# Altium project OPTO_board.PrjPcb
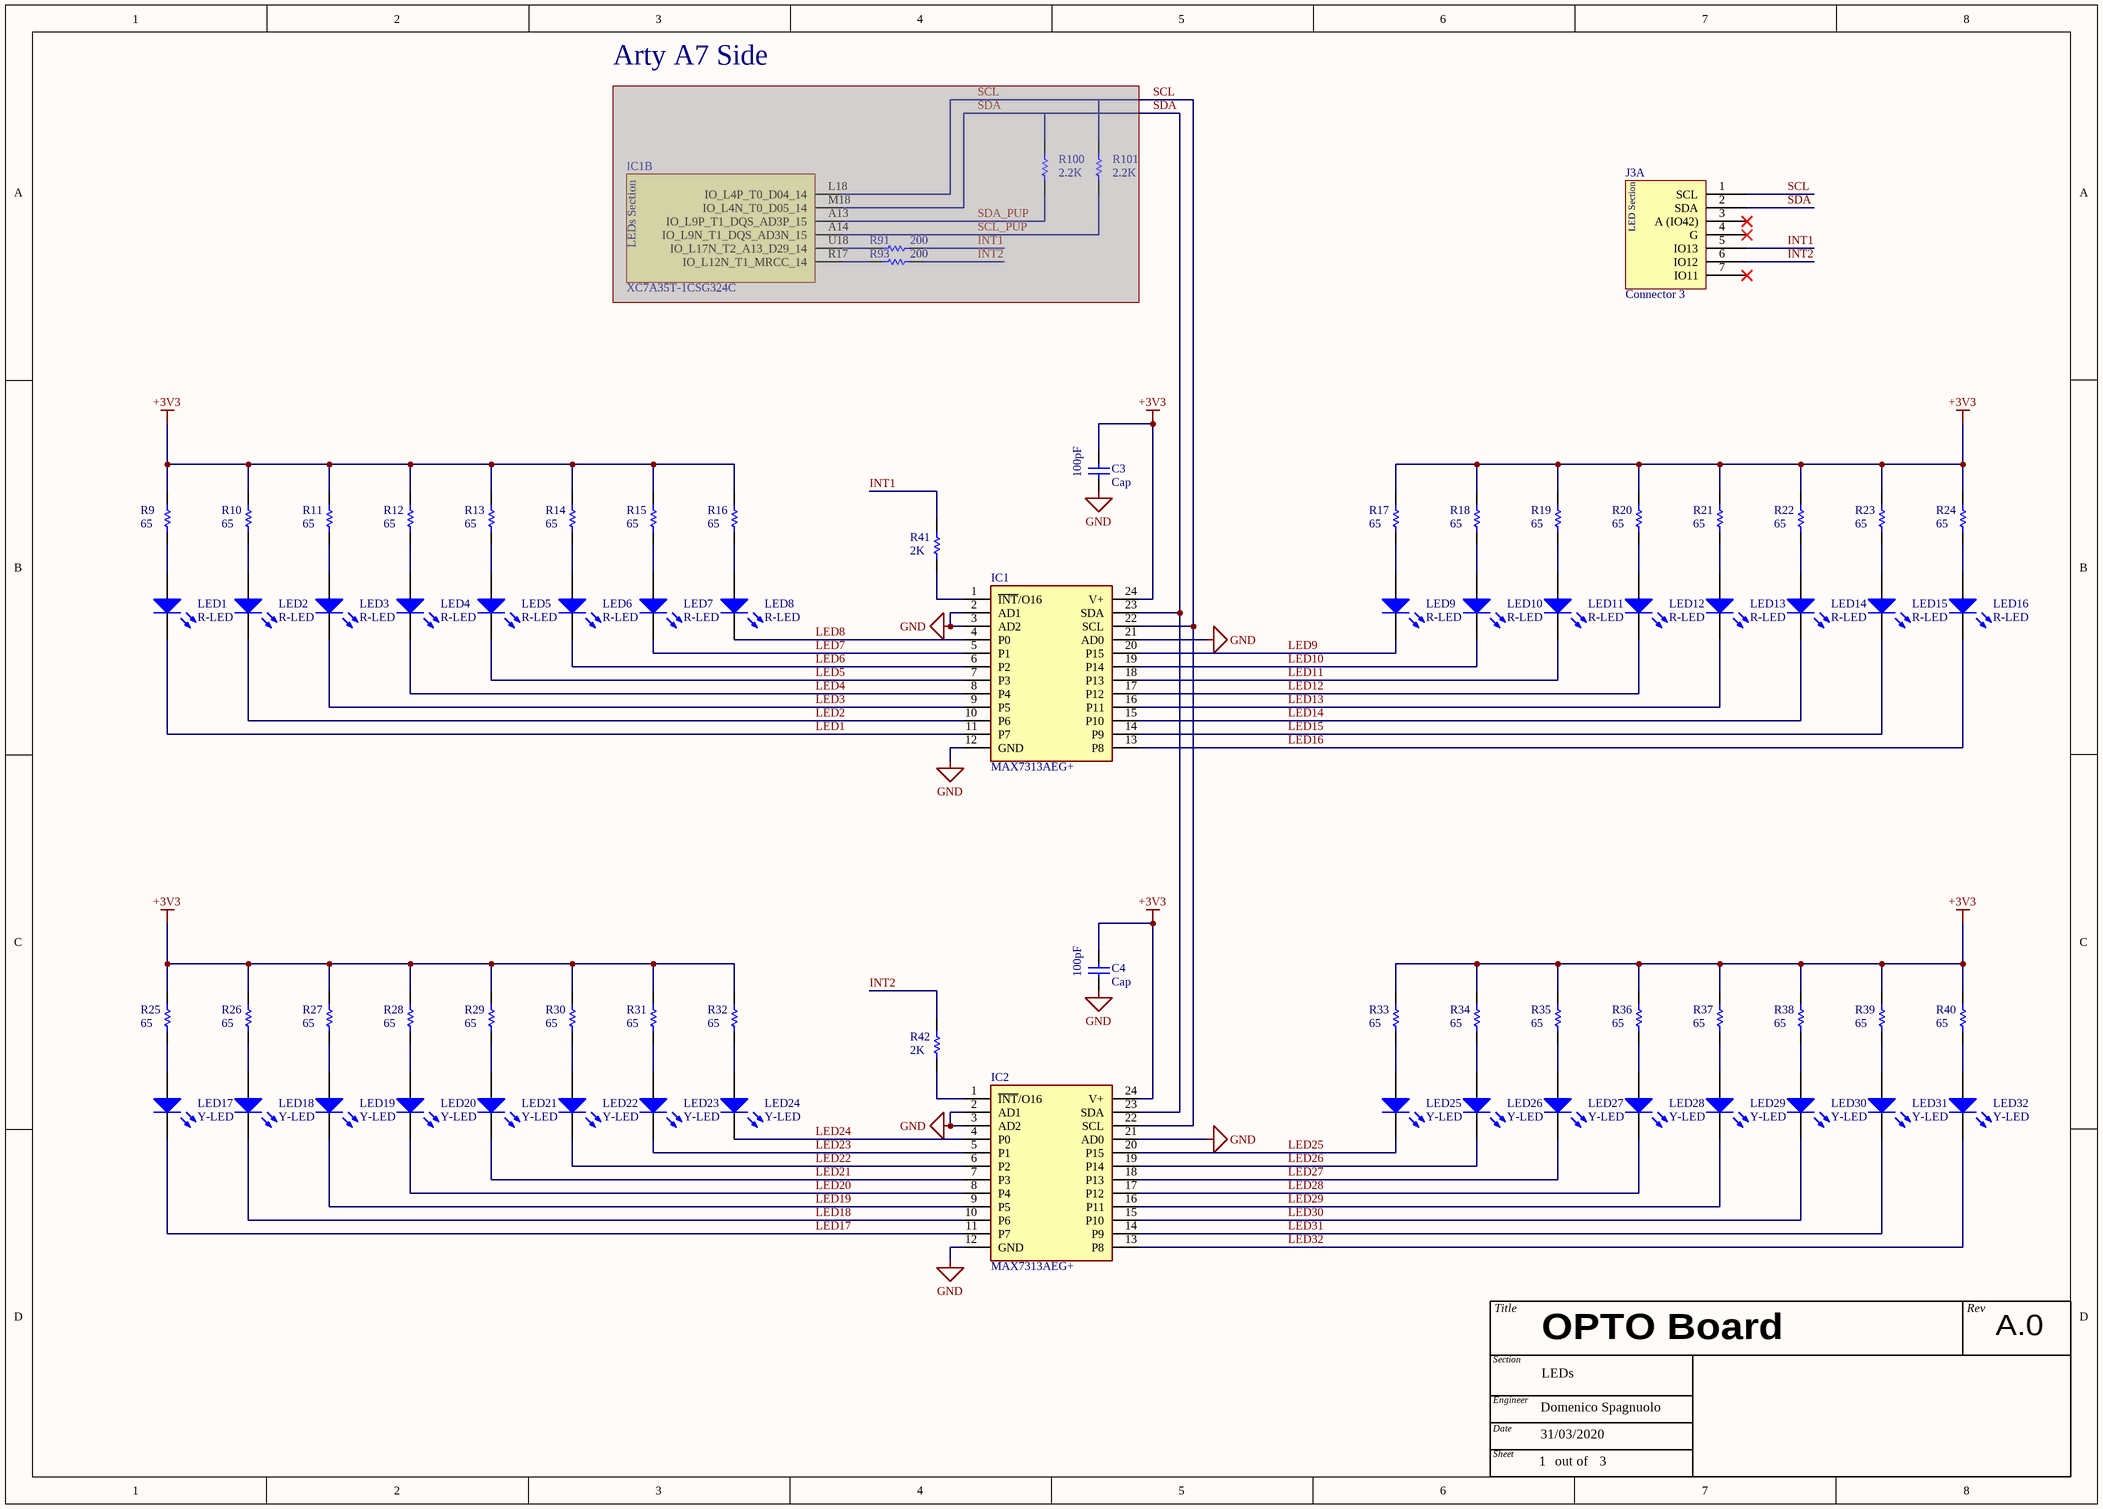
[diagram p0: LEDs.SchDoc]
Engineer: Domenico Spagnuolo; Rev: A.0
3 sheets, 131 parts. Net scope: global (net labels, ports and power ports of the same name join across sheets).
Board file: OPTO_board.PcbDoc
Sheets:
  LEDs.SchDoc
  LCD.SchDoc
  SevenSegmentDisplay.SchDoc

## Sheet LEDs.SchDoc: OPTO Board
size A3; Date: 31/03/2020; Engineer: Domenico Spagnuolo; DocumentNumber: 1; SheetNumber: 1; SheetTotal: 3; Section: LEDs

### Parts
(Parts that share a designator on the sheet are numbered #1, #2 ... from top to bottom, then left to right.)
C3  Cap  value 100pF  [CAP 0805]
C4  Cap  value 100pF  [CAP 0805]
IC1#1  XC7A35T-1CSG324C  [BGA324C80P18X18_1500X1500X150]  (part B of 3)  (masked out: inside a compile mask, not in the netlist)
IC1#2  MAX7313AEG+  [SOP64P602X175-24N]
IC2  MAX7313AEG+  [SOP64P602X175-24N]
J3  Connector 3  [1x10 Header]  (part A of 2)
LED1  R-LED  [LED RED 0805]
LED2  R-LED  [LED RED 0805]
LED3  R-LED  [LED RED 0805]
LED4  R-LED  [LED RED 0805]
LED5  R-LED  [LED RED 0805]
LED6  R-LED  [LED RED 0805]
LED7  R-LED  [LED RED 0805]
LED8  R-LED  [LED RED 0805]
LED9  R-LED  [LED RED 0805]
LED10  R-LED  [LED RED 0805]
LED11  R-LED  [LED RED 0805]
LED12  R-LED  [LED RED 0805]
LED13  R-LED  [LED RED 0805]
LED14  R-LED  [LED RED 0805]
LED15  R-LED  [LED RED 0805]
LED16  R-LED  [LED RED 0805]
LED17  Y-LED  [LED YELLOW 0805]
LED18  Y-LED  [LED YELLOW 0805]
LED19  Y-LED  [LED YELLOW 0805]
LED20  Y-LED  [LED YELLOW 0805]
LED21  Y-LED  [LED YELLOW 0805]
LED22  Y-LED  [LED YELLOW 0805]
LED23  Y-LED  [LED YELLOW 0805]
LED24  Y-LED  [LED YELLOW 0805]
LED25  Y-LED  [LED YELLOW 0805]
LED26  Y-LED  [LED YELLOW 0805]
LED27  Y-LED  [LED YELLOW 0805]
LED28  Y-LED  [LED YELLOW 0805]
LED29  Y-LED  [LED YELLOW 0805]
LED30  Y-LED  [LED YELLOW 0805]
LED31  Y-LED  [LED YELLOW 0805]
LED32  Y-LED  [LED YELLOW 0805]
R9  value 65  [RES 0805]  (hidden comment: Res)
R10  value 65  [RES 0805]  (hidden comment: Res)
R11  value 65  [RES 0805]  (hidden comment: Res)
R12  value 65  [RES 0805]  (hidden comment: Res)
R13  value 65  [RES 0805]  (hidden comment: Res)
R14  value 65  [RES 0805]  (hidden comment: Res)
R15  value 65  [RES 0805]  (hidden comment: Res)
R16  value 65  [RES 0805]  (hidden comment: Res)
R17  value 65  [RES 0805]  (hidden comment: Res)
R18  value 65  [RES 0805]  (hidden comment: Res)
R19  value 65  [RES 0805]  (hidden comment: Res)
R20  value 65  [RES 0805]  (hidden comment: Res)
R21  value 65  [RES 0805]  (hidden comment: Res)
R22  value 65  [RES 0805]  (hidden comment: Res)
R23  value 65  [RES 0805]  (hidden comment: Res)
R24  value 65  [RES 0805]  (hidden comment: Res)
R25  value 65  [RES 0805]  (hidden comment: Res)
R26  value 65  [RES 0805]  (hidden comment: Res)
R27  value 65  [RES 0805]  (hidden comment: Res)
R28  value 65  [RES 0805]  (hidden comment: Res)
R29  value 65  [RES 0805]  (hidden comment: Res)
R30  value 65  [RES 0805]  (hidden comment: Res)
R31  value 65  [RES 0805]  (hidden comment: Res)
R32  value 65  [RES 0805]  (hidden comment: Res)
R33  value 65  [RES 0805]  (hidden comment: Res)
R34  value 65  [RES 0805]  (hidden comment: Res)
R35  value 65  [RES 0805]  (hidden comment: Res)
R36  value 65  [RES 0805]  (hidden comment: Res)
R37  value 65  [RES 0805]  (hidden comment: Res)
R38  value 65  [RES 0805]  (hidden comment: Res)
R39  value 65  [RES 0805]  (hidden comment: Res)
R40  value 65  [RES 0805]  (hidden comment: Res)
R41  value 2K  [RES 0805]  (hidden comment: Res)
R42  value 2K  [RES 0805]  (hidden comment: Res)
R91  value 200  [RES 0805]  (hidden comment: Res)  (masked out: inside a compile mask, not in the netlist)
R93  value 200  [RES 0805]  (hidden comment: Res)  (masked out: inside a compile mask, not in the netlist)
R100  value 2.2K  [RES 0805]  (hidden comment: Res)  (masked out: inside a compile mask, not in the netlist)
R101  value 2.2K  [RES 0805]  (hidden comment: Res)  (masked out: inside a compile mask, not in the netlist)
TitleBlock#1  Title Block  (value not drawn)  (graphical)

### Nets
+3V3: C3.2 C4.2 IC1#2.24(V+) IC2.24(V+) R9.1 R10.1 R11.1 R12.1 R13.1 R14.1 R15.1 R16.1 R17.1 R18.1 R19.1 R20.1 R21.1 R22.1 R23.1 R24.1 R25.1 R26.1 R27.1 R28.1 R29.1 R30.1 R31.1 R32.1 R33.1 R34.1 R35.1 R36.1 R37.1 R38.1 R39.1 R40.1
GND: C3.1 C4.1 IC1#2.2(AD1) IC1#2.3(AD2) IC1#2.12(GND) IC1#2.21(AD0) IC2.2(AD1) IC2.3(AD2) IC2.12(GND) IC2.21(AD0)
INT1: J3.5(IO13) R41.1
INT2: J3.6(IO12) R42.1
LED1: IC1#2.11(P7) LED1.K
LED2: IC1#2.10(P6) LED2.K
LED3: IC1#2.9(P5) LED3.K
LED4: IC1#2.8(P4) LED4.K
LED5: IC1#2.7(P3) LED5.K
LED6: IC1#2.6(P2) LED6.K
LED7: IC1#2.5(P1) LED7.K
LED8: IC1#2.4(P0) LED8.K
LED9: IC1#2.20(P15) LED9.K
LED10: IC1#2.19(P14) LED10.K
LED11: IC1#2.18(P13) LED11.K
LED12: IC1#2.17(P12) LED12.K
LED13: IC1#2.16(P11) LED13.K
LED14: IC1#2.15(P10) LED14.K
LED15: IC1#2.14(P9) LED15.K
LED16: IC1#2.13(P8) LED16.K
LED17: IC2.11(P7) LED17.K
LED18: IC2.10(P6) LED18.K
LED19: IC2.9(P5) LED19.K
LED20: IC2.8(P4) LED20.K
LED21: IC2.7(P3) LED21.K
LED22: IC2.6(P2) LED22.K
LED23: IC2.5(P1) LED23.K
LED24: IC2.4(P0) LED24.K
LED25: IC2.20(P15) LED25.K
LED26: IC2.19(P14) LED26.K
LED27: IC2.18(P13) LED27.K
LED28: IC2.17(P12) LED28.K
LED29: IC2.16(P11) LED29.K
LED30: IC2.15(P10) LED30.K
LED31: IC2.14(P9) LED31.K
LED32: IC2.13(P8) LED32.K
SCL: IC1#2.22(SCL) IC2.22(SCL) J3.1(SCL)
SDA: IC1#2.23(SDA) IC2.23(SDA) J3.2(SDA)
NetIC1#2_1: IC1#2.1(~{INT}/O16) R41.2
NetIC2_1: IC2.1(~{INT}/O16) R42.2
NetLED1_A: LED1.A R9.2
NetLED2_A: LED2.A R10.2
NetLED3_A: LED3.A R11.2
NetLED4_A: LED4.A R12.2
NetLED5_A: LED5.A R13.2
NetLED6_A: LED6.A R14.2
NetLED7_A: LED7.A R15.2
NetLED8_A: LED8.A R16.2
NetLED9_A: LED9.A R17.2
NetLED10_A: LED10.A R18.2
NetLED11_A: LED11.A R19.2
NetLED12_A: LED12.A R20.2
NetLED13_A: LED13.A R21.2
NetLED14_A: LED14.A R22.2
NetLED15_A: LED15.A R23.2
NetLED16_A: LED16.A R24.2
NetLED17_A: LED17.A R25.2
NetLED18_A: LED18.A R26.2
NetLED19_A: LED19.A R27.2
NetLED20_A: LED20.A R28.2
NetLED21_A: LED21.A R29.2
NetLED22_A: LED22.A R30.2
NetLED23_A: LED23.A R31.2
NetLED24_A: LED24.A R32.2
NetLED25_A: LED25.A R33.2
NetLED26_A: LED26.A R34.2
NetLED27_A: LED27.A R35.2
NetLED28_A: LED28.A R36.2
NetLED29_A: LED29.A R37.2
NetLED30_A: LED30.A R38.2
NetLED31_A: LED31.A R39.2
NetLED32_A: LED32.A R40.2

Not connected (* = marked no-connect by the designer): J3 3(A_(IO42))* 4(G)* 7(IO11)*

### Notes on the sheet
- Arty A7 Side
- (in symbol Connector 3, part A) LED Section
- (in symbol TitleBlock) Title; Rev; OPTO Board; Section; Engineer; Date; Sheet; out of
- (in symbol XC7A35T-1CSG324C, part B) LEDs Section

### Library data of the parts
C3 C4 = Cap: Capacitor; Published: 8-Jun-2000; LatestRevisionDate: 17-Jul-2002; LatestRevisionNote: Re-released for DXP Platform.; PackageReference: RAD-0.3; Publisher: Altium Limited; PackageDescription: Radial Cap, Thru-Hole; 2 Leads; 0.3 in Pin Spacing
IC1#1 = XC7A35T-1CSG324C: Integrated Circuit; Manufacturer_Name: XILINX; Datasheet Link: http://www.xilinx.com/support/documentation/data_sheets/ds180_7Series_Overview.pdf; Height: 1.5mm; Manufacturer_Part_Number: XC7A35T-1CSG324C; Mouser Part Number: 217-XC7A35T-1CSG324C; Mouser Price/Stock: https://www.mouser.co.uk/ProductDetail/Xilinx/XC7A35T-1CSG324C?qs=rrS6PyfT74cxvR58nHYPWA%3D%3D
IC1#2 IC2 = MAX7313AEG+: GPIO Port Expander; Manufacturer_Name: Maxim Integrated; Datasheet Link: http://datasheets.maximintegrated.com/en/ds/MAX7313.pdf; Height: 1.75mm; Manufacturer_Part_Number: MAX7313AEG+; Mouser Part Number: 700-MAX7313AEG; Mouser Price/Stock: https://www.mouser.co.uk/ProductDetail/Maxim-Integrated/MAX7313AEG%2b?qs=LHmEVA8xxfbu9TMdrEq27g%3D%3D; RS Part Number: 1900494P; RS Price/Stock: http://uk.rs-online.com/web/p/products/1900494P
J3 = Connector 3: 1x10 Header; Manufacturer_Name: Amphenol; Manufacturer_Part_Number: 10129378-908001BLF; Datasheet Link: https://cdn.amphenol-icc.com/media/wysiwyg/files/drawing/10129378.pdf; Height: 8.58mm; Mouser Part Number: 649-1012937890801BLF; Mouser Price/Stock: https://www.mouser.com/Search/Refine.aspx?Keyword=649-1012937890801BLF
LED1-LED16 = R-LED: Red LED; Published: 8-Jun-2000; LatestRevisionDate: 08-Jul-2005; LatestRevisionNote: Mech Layer 1 removed.; Publisher: Altium Limited; PackageDescription: LED; 2 Leads; PackageReference: LED-0
LED17-LED32 = Y-LED: Yellow LED; Published: 8-Jun-2000; LatestRevisionDate: 08-Jul-2005; LatestRevisionNote: Mech Layer 1 removed.; Publisher: Altium Limited; PackageDescription: LED; 2 Leads; PackageReference: LED-0
R9-R42 R91 R93 R100 R101 = Res: Resistor; Published: 8-Jun-2000; LatestRevisionDate: 17-Jul-2002; LatestRevisionNote: Re-released for DXP Platform.; PackageReference: AXIAL-0.3; Publisher: Altium Limited; PackageDescription: Axial Device, Thru-Hole; 2 Leads; 0.3 in Pin Spacing
TitleBlock#1 = TitleBlock

## Sheet LCD.SchDoc
size A3; Date: 01/04/2020; Engineer: Domenico Spagnuolo; DocumentNumber: 2; SheetNumber: 2; SheetTotal: 3; Section: LCD
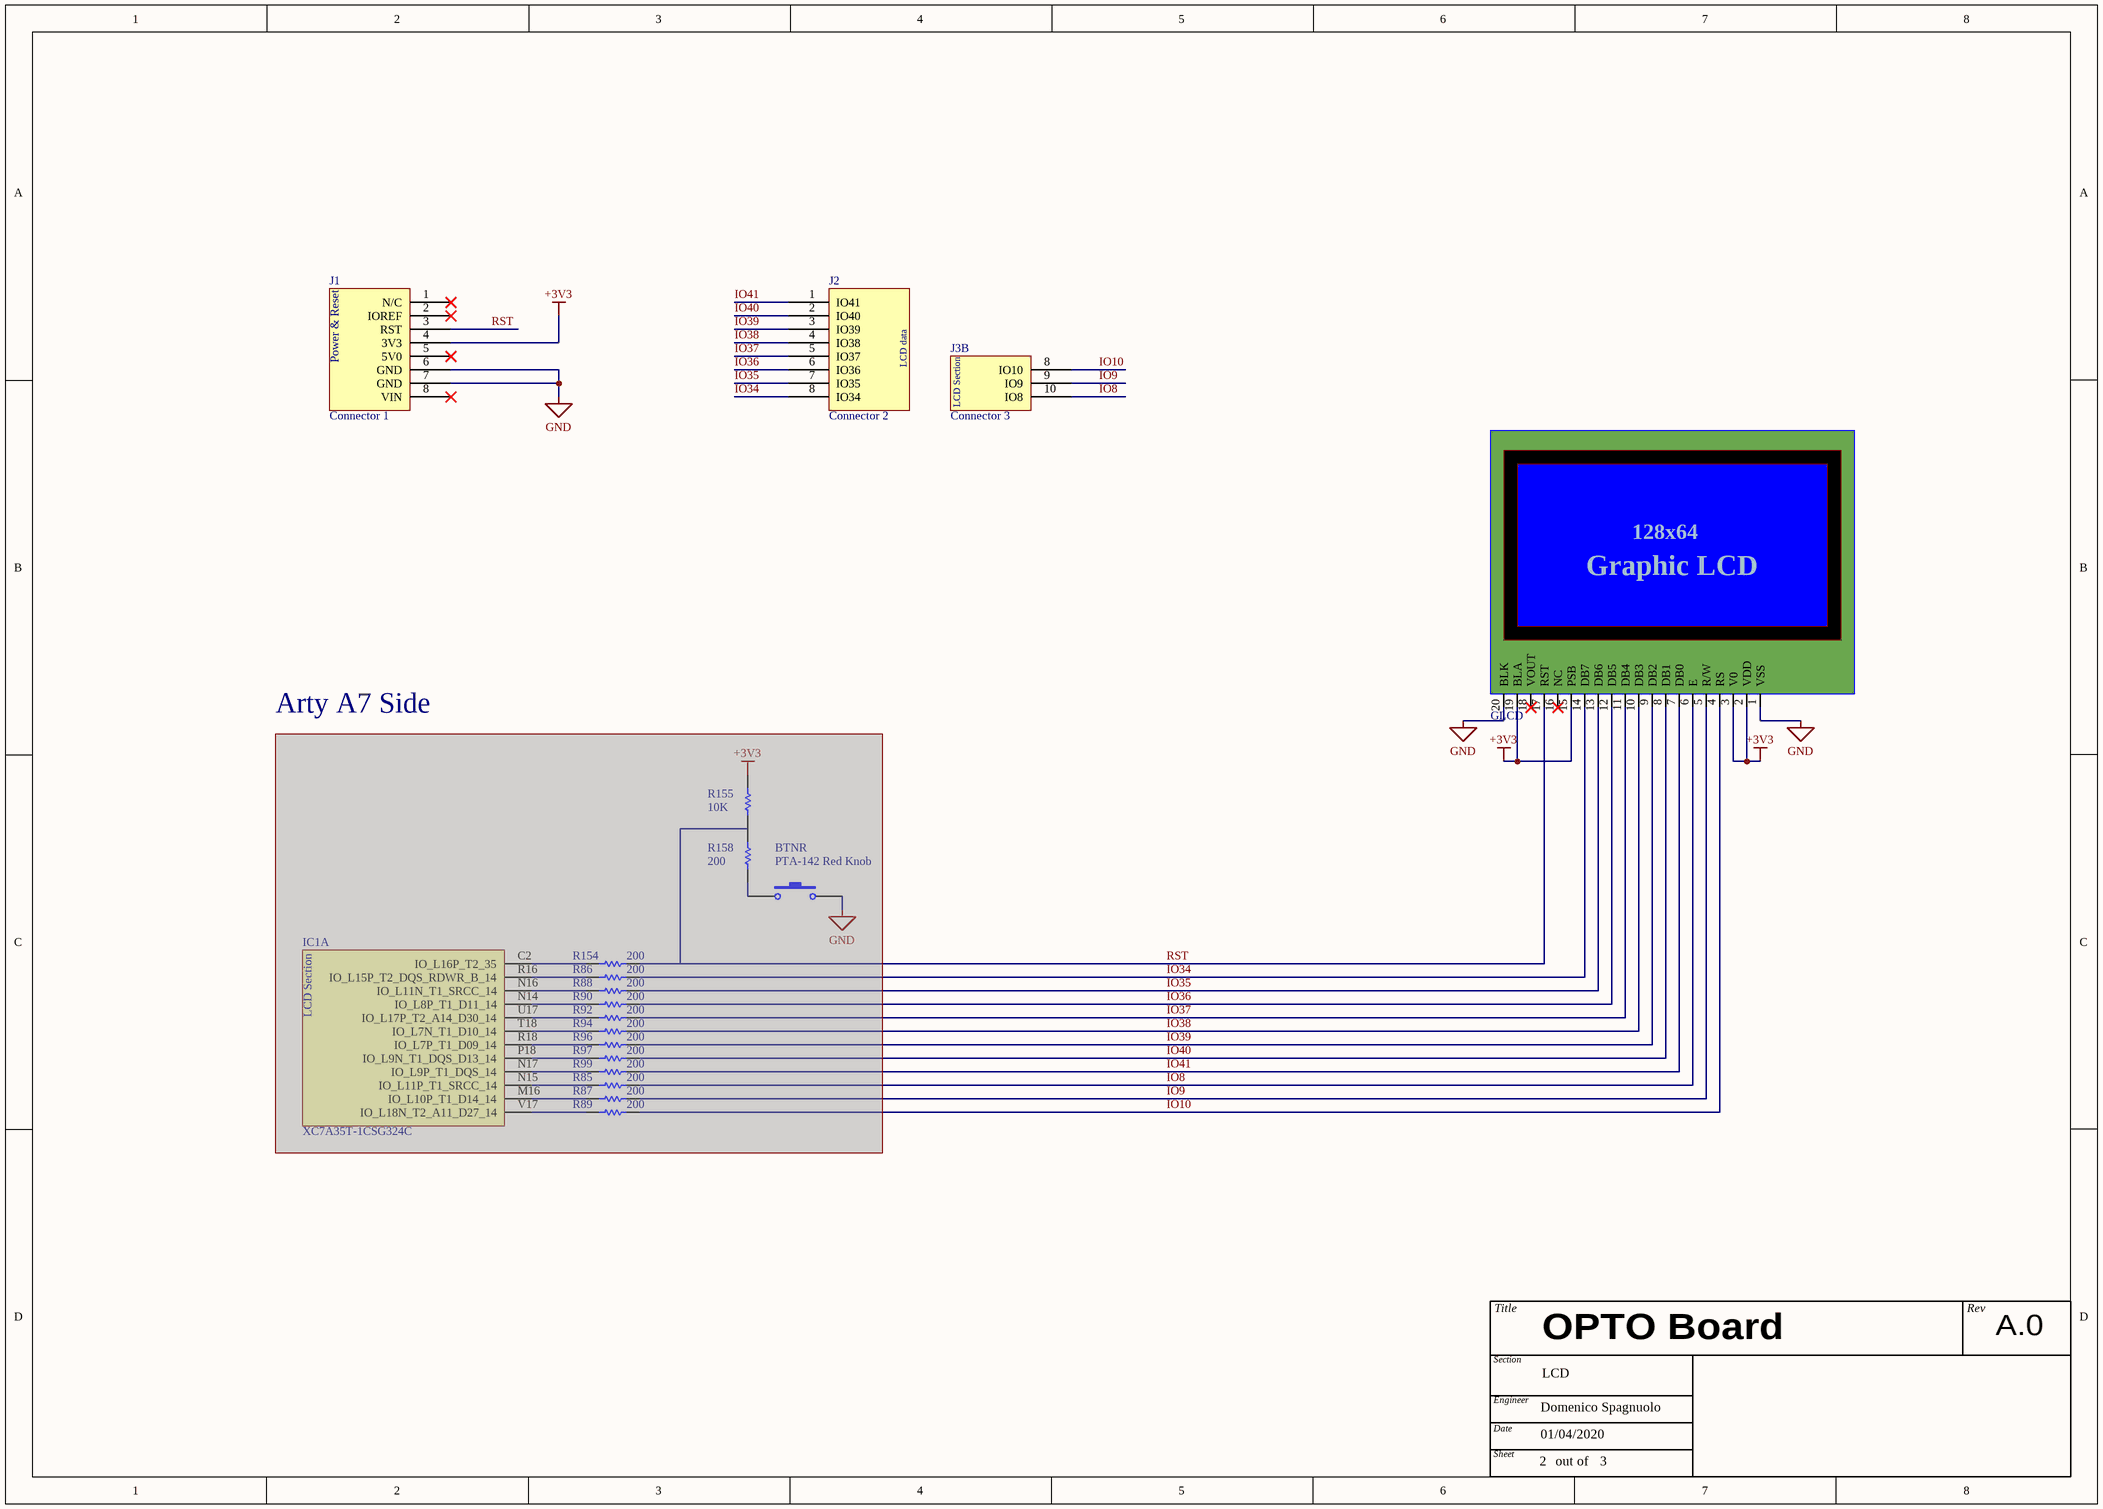
[diagram p1: LCD.SchDoc]

### Parts
(Parts that share a designator on the sheet are numbered #1, #2 ... from top to bottom, then left to right.)
BTNR  PTA-142 Red Knob  [SPST-2]  (masked out: inside a compile mask, not in the netlist)
GLCD_128x64  GLCD  [LCD 128x64]
IC1#1  XC7A35T-1CSG324C  [BGA324C80P18X18_1500X1500X150]  (part A of 3)  (masked out: inside a compile mask, not in the netlist)
J1  Connector 1  [1x8 HEADER]
J2  Connector 2  [1x8 HEADER]
J3  Connector 3  [1x10 Header]  (part B of 2)
R85  value 200  [RES 0805]  (hidden comment: Res)  (masked out: inside a compile mask, not in the netlist)
R86  value 200  [RES 0805]  (hidden comment: Res)  (masked out: inside a compile mask, not in the netlist)
R87  value 200  [RES 0805]  (hidden comment: Res)  (masked out: inside a compile mask, not in the netlist)
R88  value 200  [RES 0805]  (hidden comment: Res)  (masked out: inside a compile mask, not in the netlist)
R89  value 200  [RES 0805]  (hidden comment: Res)  (masked out: inside a compile mask, not in the netlist)
R90  value 200  [RES 0805]  (hidden comment: Res)  (masked out: inside a compile mask, not in the netlist)
R92  value 200  [RES 0805]  (hidden comment: Res)  (masked out: inside a compile mask, not in the netlist)
R94  value 200  [RES 0805]  (hidden comment: Res)  (masked out: inside a compile mask, not in the netlist)
R96  value 200  [RES 0805]  (hidden comment: Res)  (masked out: inside a compile mask, not in the netlist)
R97  value 200  [RES 0805]  (hidden comment: Res)  (masked out: inside a compile mask, not in the netlist)
R99  value 200  [RES 0805]  (hidden comment: Res)  (masked out: inside a compile mask, not in the netlist)
R154  value 200  [RES 0805]  (hidden comment: Res)  (masked out: inside a compile mask, not in the netlist)
R155  value 10K  [RES 0805]  (hidden comment: Res)  (masked out: inside a compile mask, not in the netlist)
R158  value 200  [RES 0805]  (hidden comment: Res)  (masked out: inside a compile mask, not in the netlist)
TitleBlock#2  Title Block  (value not drawn)  (graphical)

### Nets
+3V3: GLCD_128x64.2(VDD) GLCD_128x64.3(V0) GLCD_128x64.15(PSB) GLCD_128x64.19(BLA) J1.4(3V3)
GND: GLCD_128x64.1(VSS) GLCD_128x64.20(BLK) J1.6(GND) J1.7(GND)
IO8: GLCD_128x64.6(E) J3.10(IO8)
IO9: GLCD_128x64.5(R/W) J3.9(IO9)
IO10: GLCD_128x64.4(RS) J3.8(IO10)
IO34: GLCD_128x64.14(DB7) J2.8(IO34)
IO35: GLCD_128x64.13(DB6) J2.7(IO35)
IO36: GLCD_128x64.12(DB5) J2.6(IO36)
IO37: GLCD_128x64.11(DB4) J2.5(IO37)
IO38: GLCD_128x64.10(DB3) J2.4(IO38)
IO39: GLCD_128x64.9(DB2) J2.3(IO39)
IO40: GLCD_128x64.8(DB1) J2.2(IO40)
IO41: GLCD_128x64.7(DB0) J2.1(IO41)
RST: GLCD_128x64.17(RST) J1.3(RST)

Not connected (* = marked no-connect by the designer): GLCD_128x64 16(NC)* 18(VOUT)*; J1 1(N/C)* 2(IOREF)* 5(5V0)* 8(VIN)*

### Notes on the sheet
- Arty A7 Side
- (in symbol Connector 1) Power & Reset
- (in symbol Connector 2) LCD data
- (in symbol Connector 3, part B) LCD Section
- (in symbol GLCD) 128x64; Graphic LCD
- (in symbol TitleBlock) Title; Rev; OPTO Board; Section; Engineer; Date; Sheet; out of
- (in symbol XC7A35T-1CSG324C, part A) LCD Section

### Library data of the parts
BTNR = SW-PB: Switch; Published: 24-Mar-1999; LatestRevisionDate: 17-Jul-2002; LatestRevisionNote: Re-released for DXP Platform.; PackageReference: SPST-2; Publisher: Altium Limited; PackageDescription: Switch; 2 Leads
GLCD_128x64 = GLCD: Graphic LCD 128x64
IC1#1 = XC7A35T-1CSG324C: as IC1#1 on sheet LEDs; Datasheet Link: http://www.xilinx.com/support/documentation/data_sheets/ds180_7Series_Overview.pdf; Height: 1.5mm; Manufacturer_Part_Number: XC7A35T-1CSG324C; Mouser Part Number: 217-XC7A35T-1CSG324C; Mouser Price/Stock: https://www.mouser.co.uk/ProductDetail/Xilinx/XC7A35T-1CSG324C?qs=rrS6PyfT74cxvR58nHYPWA%3D%3D
J1 = Connector 1: 1x8 Header; Manufacturer_Name: Amphenol; Manufacturer_Part_Number: 10129378-908001BLF; Datasheet Link: https://cdn.amphenol-icc.com/media/wysiwyg/files/drawing/10129378.pdf; Height: 8.58mm; Mouser Part Number: 649-1012937890801BLF; Mouser Price/Stock: https://www.mouser.com/Search/Refine.aspx?Keyword=649-1012937890801BLF
J2 = Connector 2: 1x8 Header; Manufacturer_Name: Amphenol; Manufacturer_Part_Number: 10129378-908001BLF; Datasheet Link: https://cdn.amphenol-icc.com/media/wysiwyg/files/drawing/10129378.pdf; Height: 8.58mm; Mouser Part Number: 649-1012937890801BLF; Mouser Price/Stock: https://www.mouser.com/Search/Refine.aspx?Keyword=649-1012937890801BLF
J3 = Connector 3: as J3 on sheet LEDs; Datasheet Link: https://cdn.amphenol-icc.com/media/wysiwyg/files/drawing/10129378.pdf; Height: 8.58mm; Mouser Part Number: 649-1012937890801BLF; Mouser Price/Stock: https://www.mouser.com/Search/Refine.aspx?Keyword=649-1012937890801BLF
R85-R90 R92 R94 R96 R97 R99 R154 R155 R158 = Res: Resistor; Published: 8-Jun-2000; LatestRevisionDate: 17-Jul-2002; LatestRevisionNote: Re-released for DXP Platform.; PackageReference: AXIAL-0.3; Publisher: Altium Limited; PackageDescription: Axial Device, Thru-Hole; 2 Leads; 0.3 in Pin Spacing
TitleBlock#2 = TitleBlock

## Sheet SevenSegmentDisplay.SchDoc
size A3; Date: 01/04/2020; Engineer: Domenico Spagnuolo; DocumentNumber: 3; SheetNumber: 3; SheetTotal: 3; Section: 7 Segment Diplays
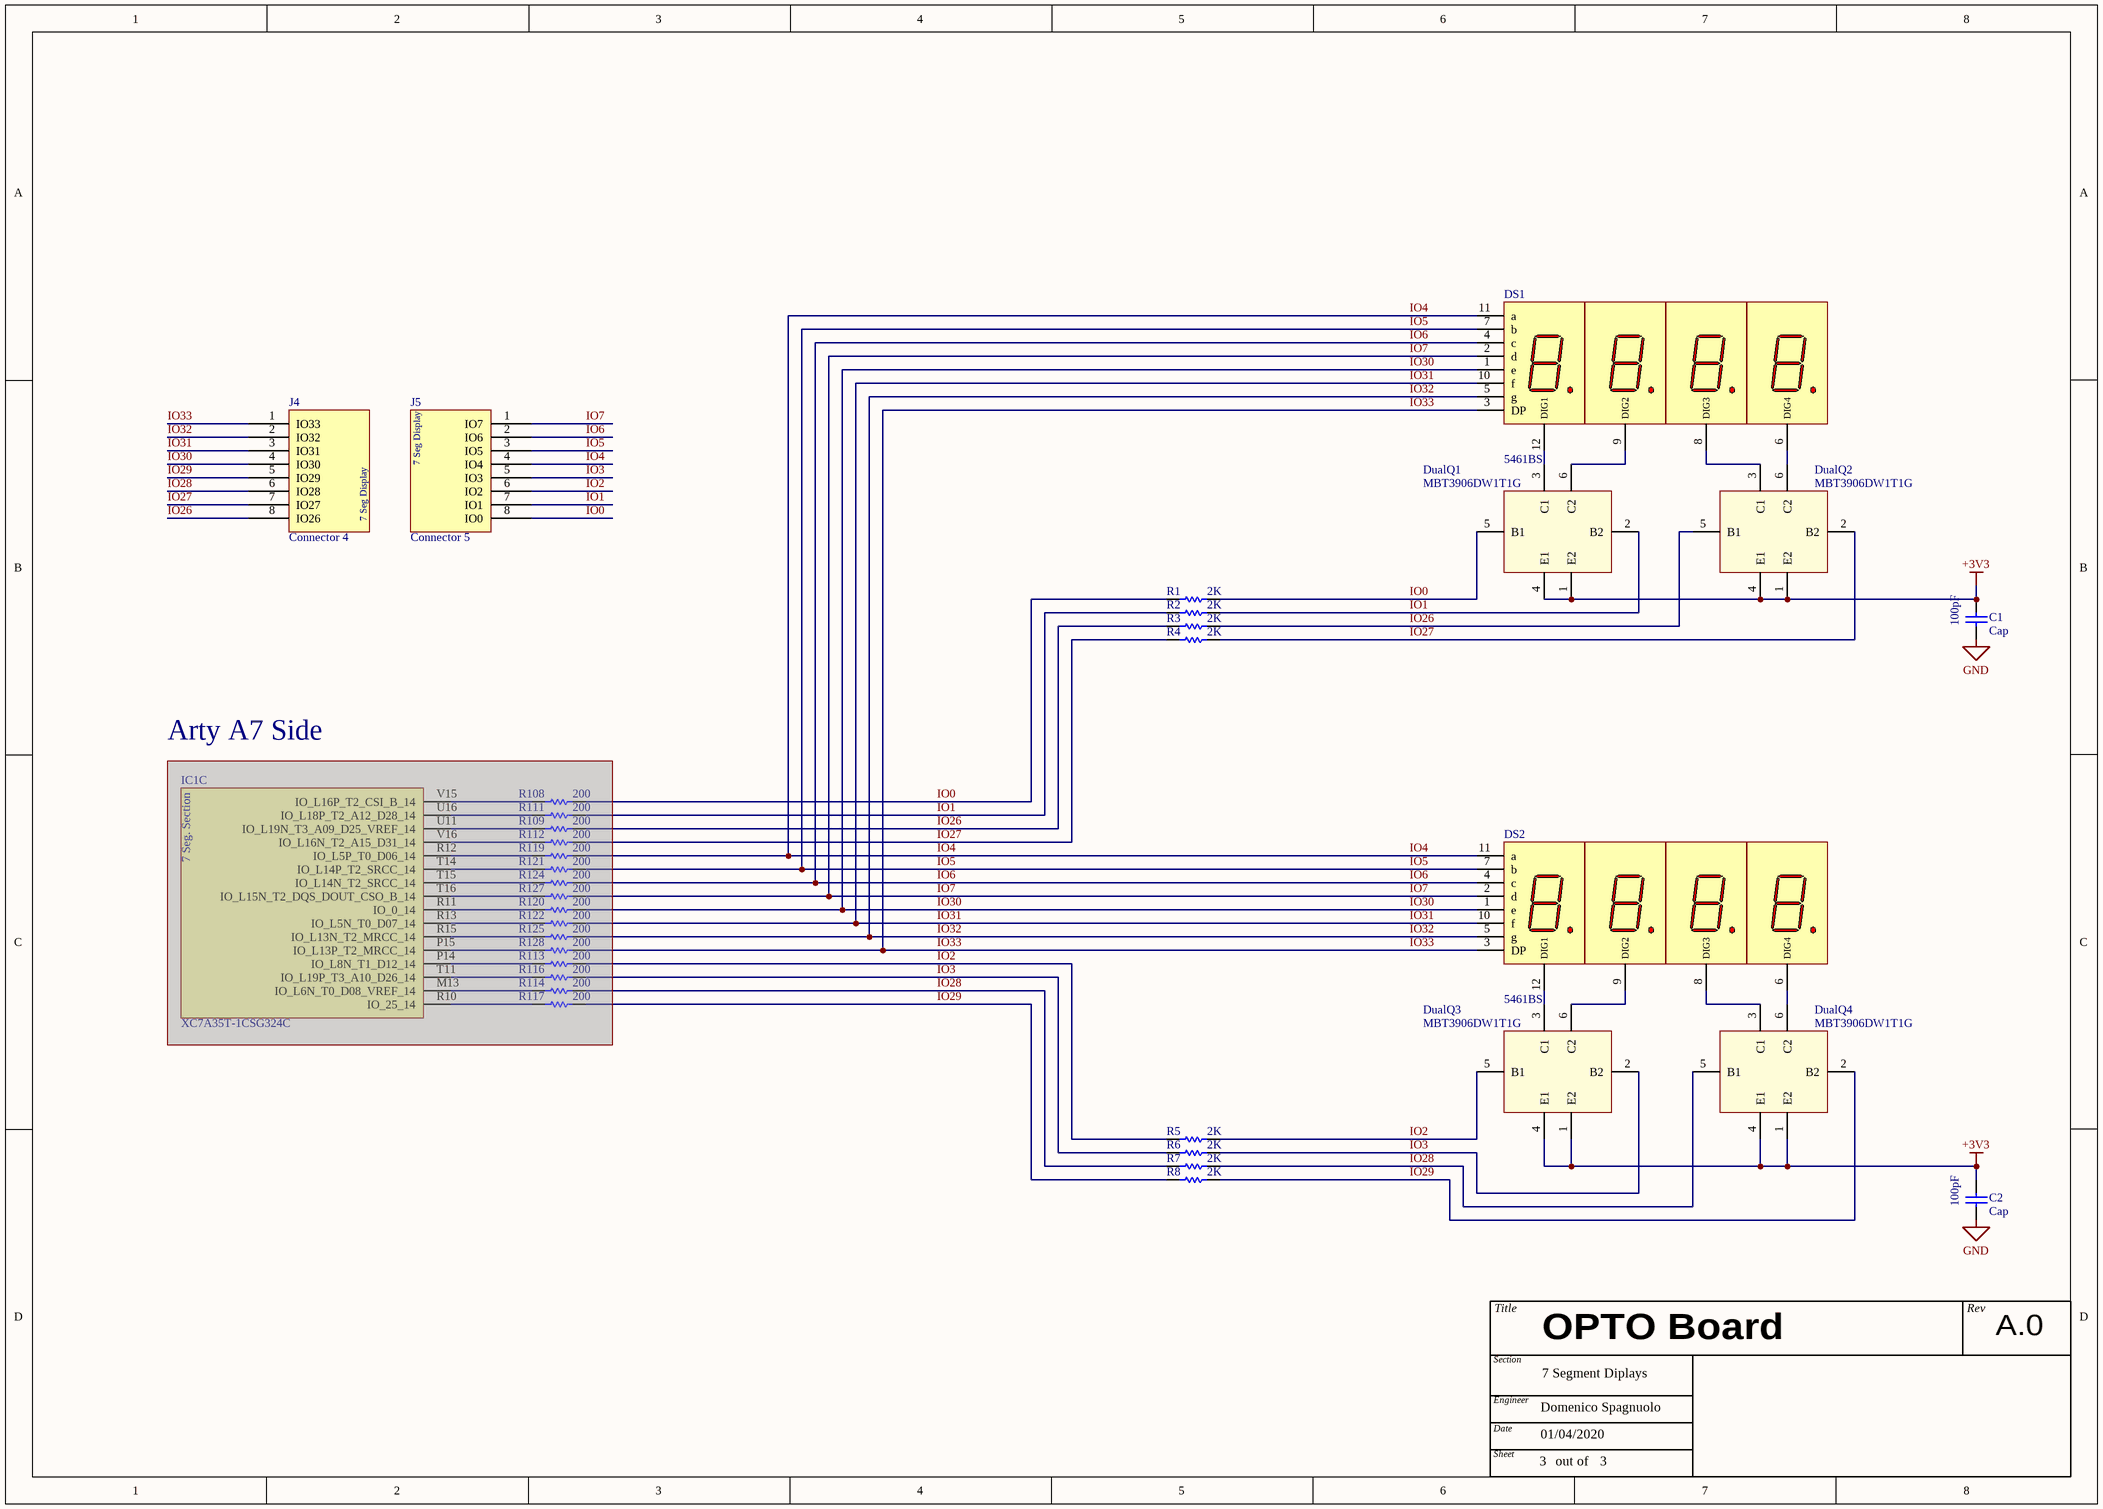
[diagram p2: SevenSegmentDisplay.SchDoc]

### Parts
(Parts that share a designator on the sheet are numbered #1, #2 ... from top to bottom, then left to right.)
C1  Cap  value 100pF  [CAP 0805]
C2  Cap  value 100pF  [CAP 0805]
DS1  5461BS  [5461BS]
DS2  5461BS  [5461BS]
DualQ1  MBT3906DW1T1G  [MBT3906DW1T1G]
DualQ2  MBT3906DW1T1G  [MBT3906DW1T1G]
DualQ3  MBT3906DW1T1G  [MBT3906DW1T1G]
DualQ4  MBT3906DW1T1G  [MBT3906DW1T1G]
IC1#1  XC7A35T-1CSG324C  [BGA324C80P18X18_1500X1500X150]  (part C of 3)  (masked out: inside a compile mask, not in the netlist)
J4  Connector 4  [1x8 HEADER]
J5  Connector 5  [1x8 HEADER]
R1  value 2K  [RES 0805]  (hidden comment: Res)
R2  value 2K  [RES 0805]  (hidden comment: Res)
R3  value 2K  [RES 0805]  (hidden comment: Res)
R4  value 2K  [RES 0805]  (hidden comment: Res)
R5  value 2K  [RES 0805]  (hidden comment: Res)
R6  value 2K  [RES 0805]  (hidden comment: Res)
R7  value 2K  [RES 0805]  (hidden comment: Res)
R8  value 2K  [RES 0805]  (hidden comment: Res)
R108  value 200  [RES 0805]  (hidden comment: Res)  (masked out: inside a compile mask, not in the netlist)
R109  value 200  [RES 0805]  (hidden comment: Res)  (masked out: inside a compile mask, not in the netlist)
R111  value 200  [RES 0805]  (hidden comment: Res)  (masked out: inside a compile mask, not in the netlist)
R112  value 200  [RES 0805]  (hidden comment: Res)  (masked out: inside a compile mask, not in the netlist)
R113  value 200  [RES 0805]  (hidden comment: Res)  (masked out: inside a compile mask, not in the netlist)
R114  value 200  [RES 0805]  (hidden comment: Res)  (masked out: inside a compile mask, not in the netlist)
R116  value 200  [RES 0805]  (hidden comment: Res)  (masked out: inside a compile mask, not in the netlist)
R117  value 200  [RES 0805]  (hidden comment: Res)  (masked out: inside a compile mask, not in the netlist)
R119  value 200  [RES 0805]  (hidden comment: Res)  (masked out: inside a compile mask, not in the netlist)
R120  value 200  [RES 0805]  (hidden comment: Res)  (masked out: inside a compile mask, not in the netlist)
R121  value 200  [RES 0805]  (hidden comment: Res)  (masked out: inside a compile mask, not in the netlist)
R122  value 200  [RES 0805]  (hidden comment: Res)  (masked out: inside a compile mask, not in the netlist)
R124  value 200  [RES 0805]  (hidden comment: Res)  (masked out: inside a compile mask, not in the netlist)
R125  value 200  [RES 0805]  (hidden comment: Res)  (masked out: inside a compile mask, not in the netlist)
R127  value 200  [RES 0805]  (hidden comment: Res)  (masked out: inside a compile mask, not in the netlist)
R128  value 200  [RES 0805]  (hidden comment: Res)  (masked out: inside a compile mask, not in the netlist)
TitleBlock#3  Title Block  (value not drawn)  (graphical)

### Nets
+3V3: C1.2 C2.2 DualQ1.1(E2) DualQ1.4(E1) DualQ2.1(E2) DualQ2.4(E1) DualQ3.1(E2) DualQ3.4(E1) DualQ4.1(E2) DualQ4.4(E1)
GND: C1.1 C2.1
IO0: DualQ1.5(B1) J5.8(IO0) R1.1 R1.2
IO1: DualQ1.2(B2) J5.7(IO1) R2.1 R2.2
IO2: DualQ3.5(B1) J5.6(IO2) R5.1 R5.2
IO3: DualQ3.2(B2) J5.5(IO3) R6.1 R6.2
IO4: DS1.11(a) DS2.11(a) J5.4(IO4)
IO5: DS1.7(b) DS2.7(b) J5.3(IO5)
IO6: DS1.4(c) DS2.4(c) J5.2(IO6)
IO7: DS1.2(d) DS2.2(d) J5.1(IO7)
IO26: DualQ2.5(B1) J4.8(IO26) R3.1 R3.2
IO27: DualQ2.2(B2) J4.7(IO27) R4.1 R4.2
IO28: DualQ4.5(B1) J4.6(IO28) R7.1 R7.2
IO29: DualQ4.2(B2) J4.5(IO29) R8.1 R8.2
IO30: DS1.1(e) DS2.1(e) J4.4(IO30)
IO31: DS1.10(f) DS2.10(f) J4.3(IO31)
IO32: DS1.5(g) DS2.5(g) J4.2(IO32)
IO33: DS1.3(DP) DS2.3(DP) J4.1(IO33)
NetDS1_6: DS1.6(DIG4) DualQ2.6(C2)
NetDS1_8: DS1.8(DIG3) DualQ2.3(C1)
NetDS1_9: DS1.9(DIG2) DualQ1.6(C2)
NetDS1_12: DS1.12(DIG1) DualQ1.3(C1)
NetDS2_6: DS2.6(DIG4) DualQ4.6(C2)
NetDS2_8: DS2.8(DIG3) DualQ4.3(C1)
NetDS2_9: DS2.9(DIG2) DualQ3.6(C2)
NetDS2_12: DS2.12(DIG1) DualQ3.3(C1)

### Notes on the sheet
- Arty A7 Side
- (in symbol Connector 4) 7 Seg Display
- (in symbol Connector 5) 7 Seg Display
- (in symbol TitleBlock) Title; Rev; OPTO Board; Section; Engineer; Date; Sheet; out of
- (in symbol XC7A35T-1CSG324C, part C) 7 Seg. Section

### Library data of the parts
C1 C2 = Cap: Capacitor; Published: 8-Jun-2000; LatestRevisionDate: 17-Jul-2002; LatestRevisionNote: Re-released for DXP Platform.; PackageReference: RAD-0.3; Publisher: Altium Limited; PackageDescription: Radial Cap, Thru-Hole; 2 Leads; 0.3 in Pin Spacing
DS1 DS2 = 5461BS: 4 Digit Display (Red); MinimumIntensity: 360 ucd; Note: Pins 1 and 6 are redundant Anodes.; Colour: High Efficiency Red (HER); Published: 8-Jun-2000; LatestRevisionDate: 17-Dec-2003; LatestRevisionNote: Schematic revised, PCB Footprint replaced.; DatasheetVersion: 19-Feb-2002; PackageVersion: 11-Feb-2002; PackageReference: A; Publisher: Altium Limited; PackageDescription: LED, 7-Segment Display, 7.62 mm, RHD; 10 Leads; Row Space 5.08 mm; Pitch 2.54 mm; ComponentLink1Description: Manufacturer Link; ComponentLink1URL: http://www.agilent.com/
DualQ1-DualQ4 = MBT3906DW1T1G: Dual Transistors; Manufacturer_Name: ON Semiconductor; Datasheet Link: http://www.onsemi.com/pub/Collateral/MBT3906DW1T1-D.PDF; Height: 1.1mm; Manufacturer_Part_Number: MBT3906DW1T1G; Mouser Part Number: 863-MBT3906DW1T1G; Mouser Price/Stock: https://www.mouser.com/Search/Refine.aspx?Keyword=863-MBT3906DW1T1G; RS Part Number: 7916075P; RS Price/Stock: http://uk.rs-online.com/web/p/products/7916075P; Name: MBT3906DW1T1G
IC1#1 = XC7A35T-1CSG324C: as IC1#1 on sheet LEDs; Datasheet Link: http://www.xilinx.com/support/documentation/data_sheets/ds180_7Series_Overview.pdf; Height: 1.5mm; Manufacturer_Part_Number: XC7A35T-1CSG324C; Mouser Part Number: 217-XC7A35T-1CSG324C; Mouser Price/Stock: https://www.mouser.co.uk/ProductDetail/Xilinx/XC7A35T-1CSG324C?qs=rrS6PyfT74cxvR58nHYPWA%3D%3D
J4 = Connector 4: 1x8 Header; Manufacturer_Name: Amphenol; Manufacturer_Part_Number: 10129378-908001BLF; Datasheet Link: https://cdn.amphenol-icc.com/media/wysiwyg/files/drawing/10129378.pdf; Height: 8.58mm; Mouser Part Number: 649-1012937890801BLF; Mouser Price/Stock: https://www.mouser.com/Search/Refine.aspx?Keyword=649-1012937890801BLF
J5 = Connector 5: 1x8 Header; Manufacturer_Name: Amphenol; Manufacturer_Part_Number: 10129378-908001BLF; Datasheet Link: https://cdn.amphenol-icc.com/media/wysiwyg/files/drawing/10129378.pdf; Height: 8.58mm; Mouser Part Number: 649-1012937890801BLF; Mouser Price/Stock: https://www.mouser.com/Search/Refine.aspx?Keyword=649-1012937890801BLF
R1-R8 R108 R109 R111-R114 R116 R117 R119-R122 R124 R125 R127 R128 = Res: Resistor; Published: 8-Jun-2000; LatestRevisionDate: 17-Jul-2002; LatestRevisionNote: Re-released for DXP Platform.; PackageReference: AXIAL-0.3; Publisher: Altium Limited; PackageDescription: Axial Device, Thru-Hole; 2 Leads; 0.3 in Pin Spacing
TitleBlock#3 = TitleBlock

## Nets that join several sheets
+3V3: LEDs (36 pins), LCD (5 pins), SevenSegmentDisplay (10 pins)
GND: LEDs (10 pins), LCD (GLCD_128x64.1 GLCD_128x64.20 J1.6 J1.7), SevenSegmentDisplay (C1.1 C2.1)